# EAGLE board PFCEDU_V3 (EAGLE 9.1.1), part 1 of 2
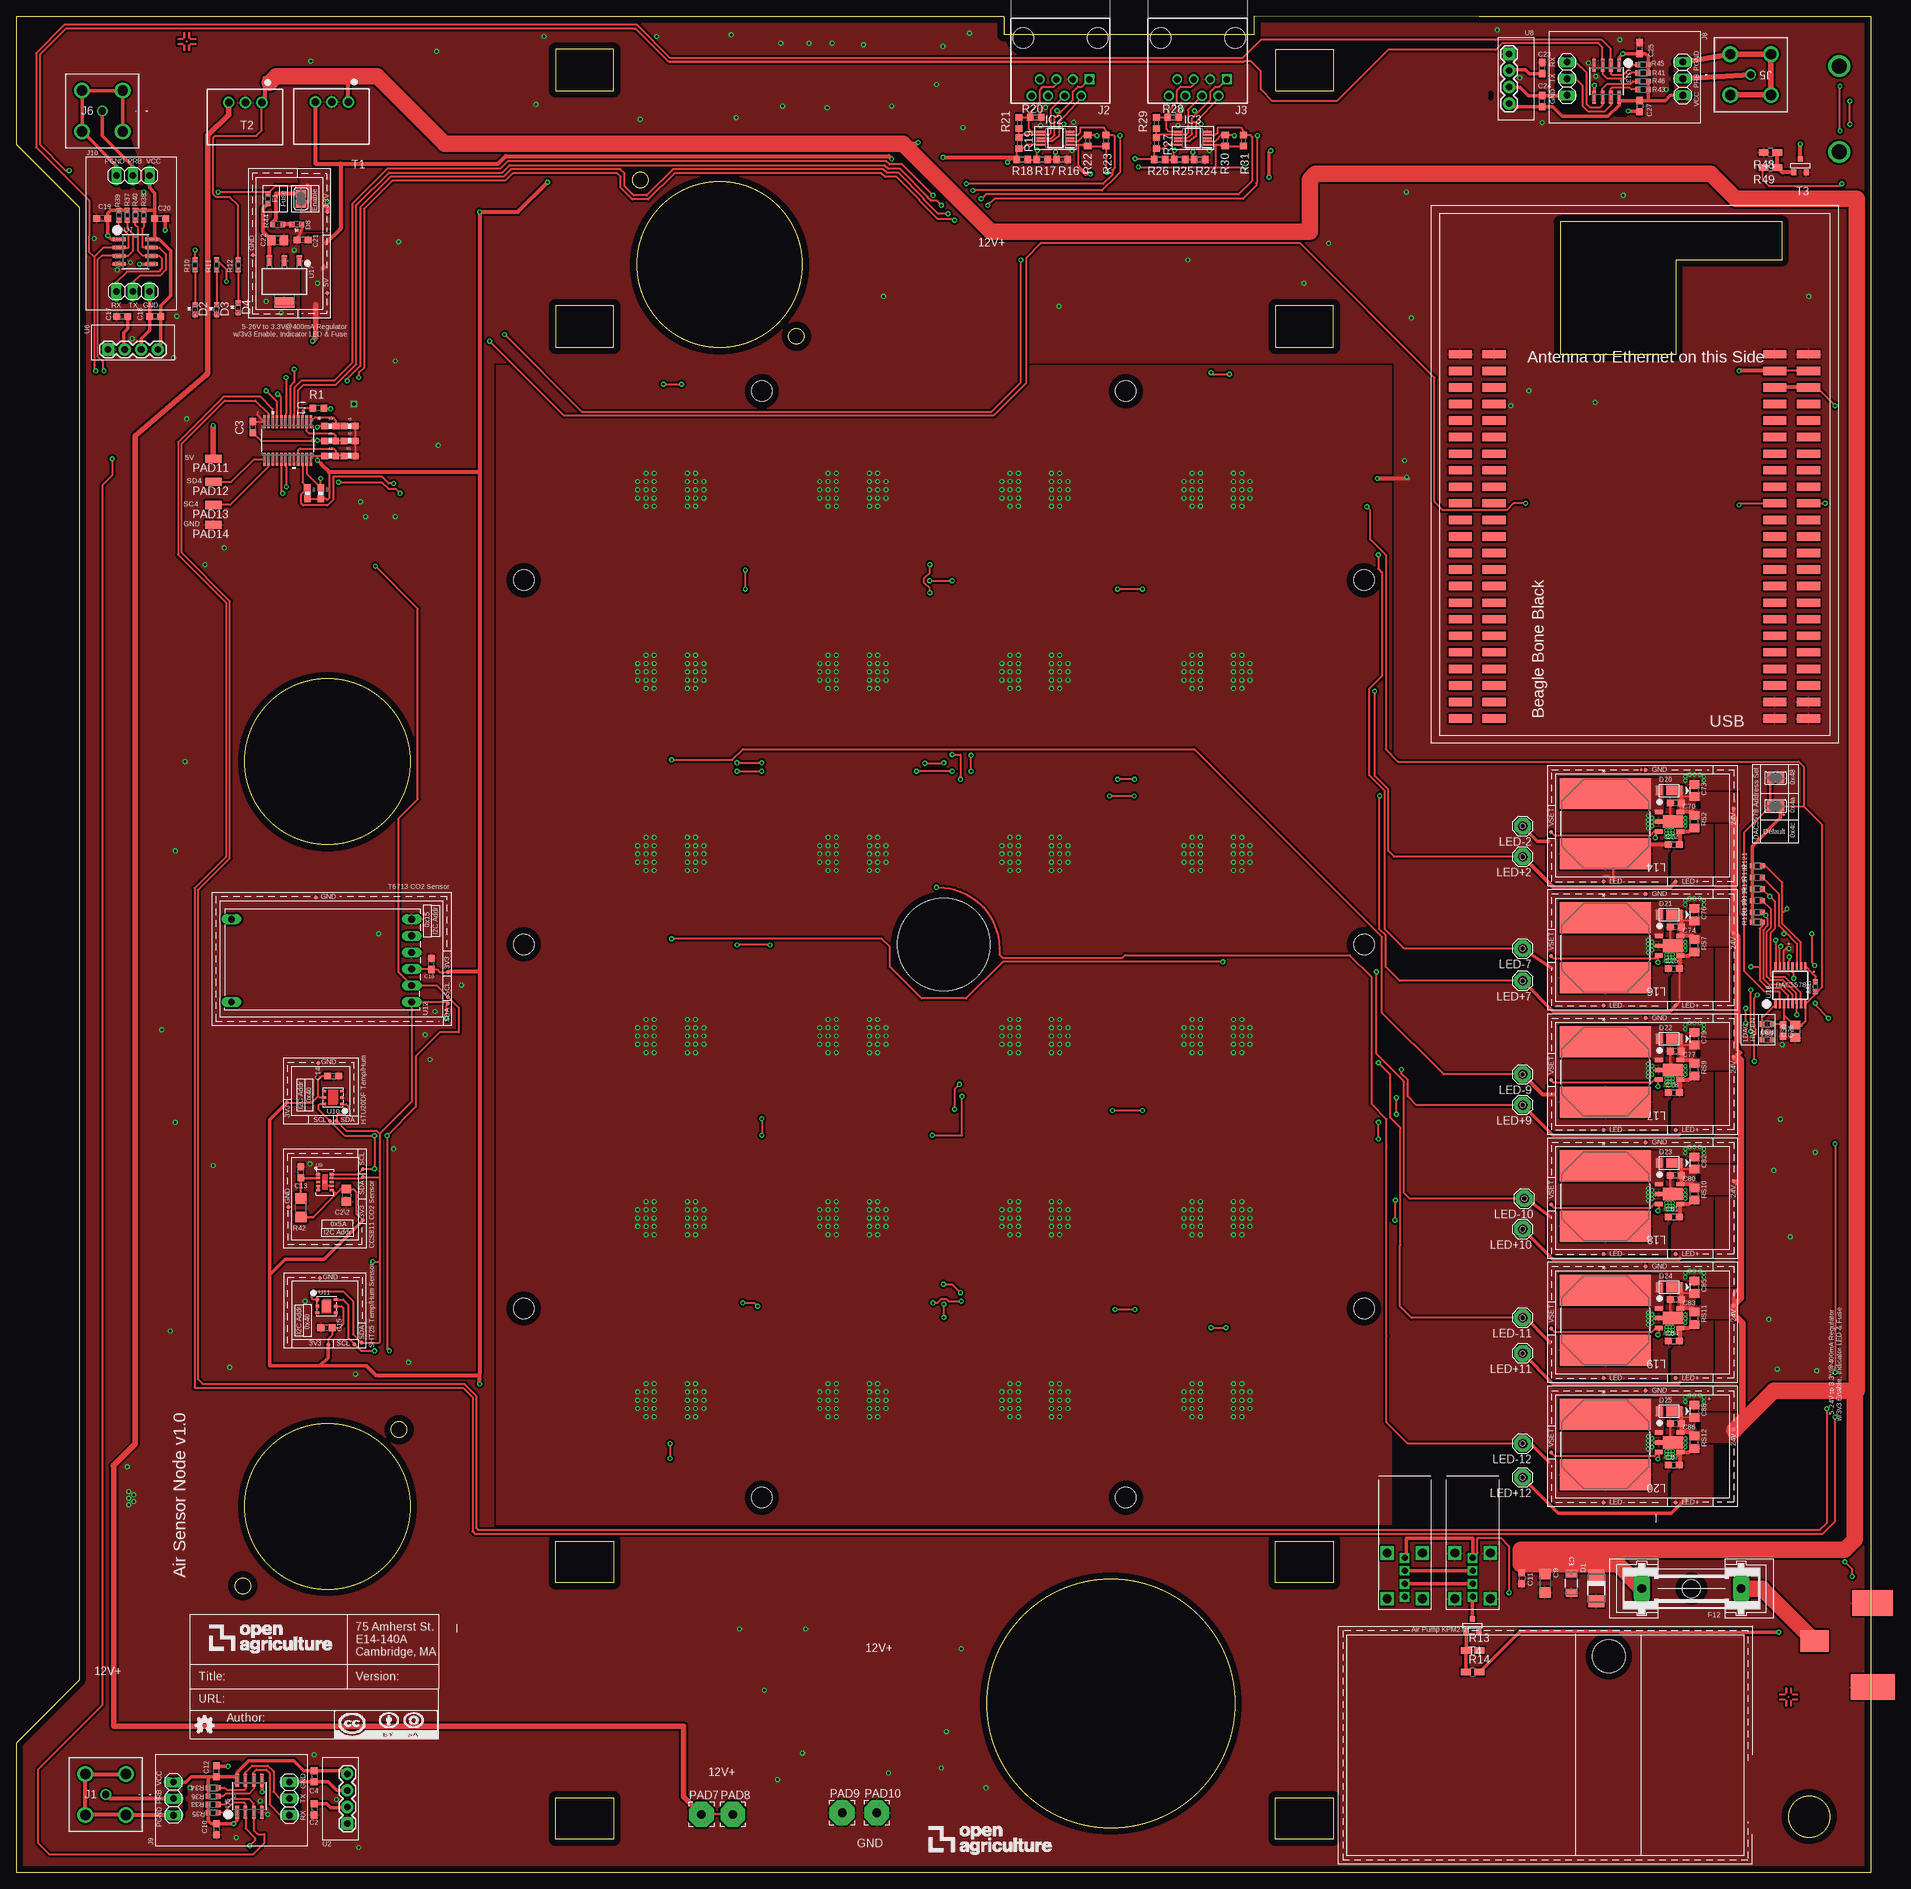
[diagram p5: board, top side]
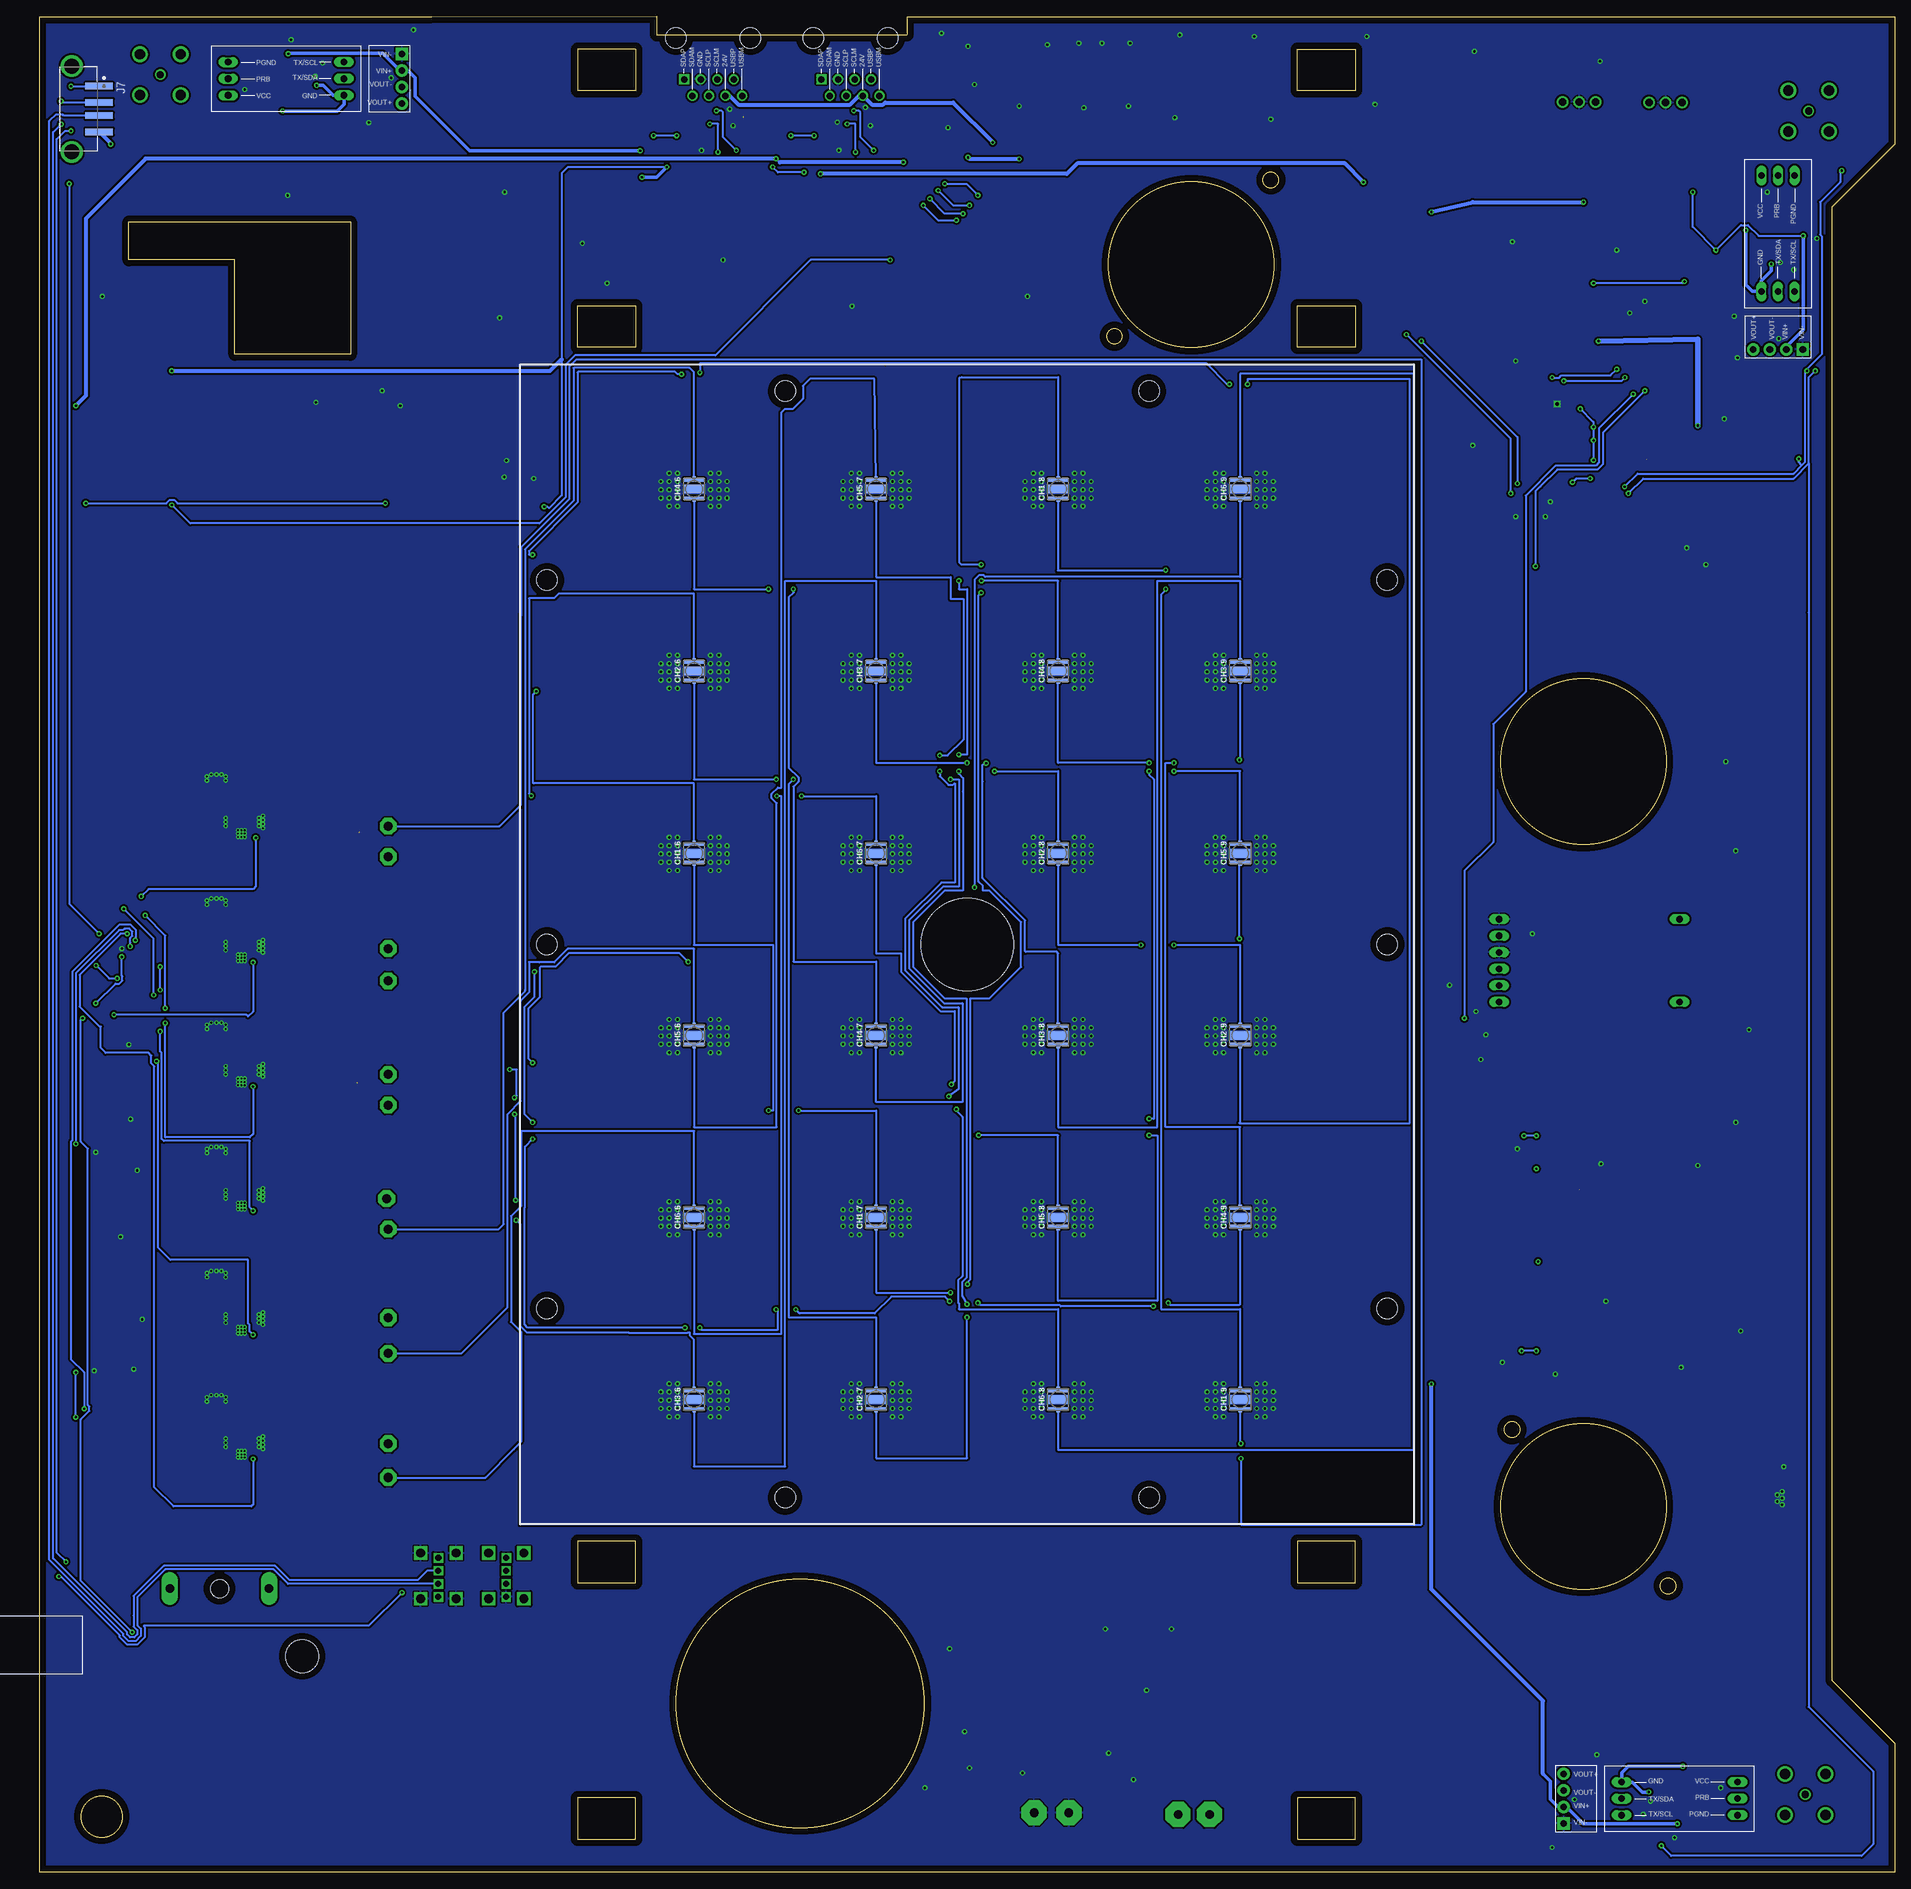
[diagram p6: board, bottom side, seen from below]

Size 284.73 x 284.79 mm. Coordinates in mm from the lower left corner, seen from the top.
Outline: 224.54,284.73 284.73,284.73 284.73,0 0,0 0,19.81 9.65,29.46 9.65,255.52 0,265.18 0,284.73 151.62,284.73 151.62,281.94 189.99,281.94 189.99,284.79 224.73,284.73
Outline: 91.66,279.71 82.77,279.71 82.77,273.36 91.66,273.36 91.66,279.71
Outline: 91.66,240.34 82.77,240.34 82.77,233.99 91.66,233.99 91.66,240.34
Outline: 202.15,240.34 193.26,240.34 193.26,233.99 202.15,233.99 202.15,240.34
Outline: 193.26,273.36 202.15,273.36 202.15,279.71 193.26,279.71 193.26,273.36
Outline: 202.15,11.43 202.15,5.08 193.26,5.08 193.26,11.43 202.15,11.43
Outline: 202.15,50.8 202.15,44.45 193.26,44.45 193.26,50.8 202.15,50.8
Outline: 91.66,11.43 91.66,5.08 82.77,5.08 82.77,11.43 91.66,11.43
Outline: 91.66,50.8 91.66,44.45 82.77,44.45 82.77,50.8 91.66,50.8
Outline: 236.98,253.24 236.98,232.92 254.76,232.92 254.76,247.4 271.02,247.4 271.02,253.24 236.98,253.24
Outline: circle at 275.2,8.55 radius 3.17
Outline: circle at 119.75,235.7 radius 1.2
Outline: circle at 95.76,259.68 radius 1.2
Outline: circle at 58.75,67.93 radius 1.2
Outline: circle at 34.76,43.94 radius 1.2
Outline: circle at 47.75,170.43 radius 12.7
Outline: circle at 47.75,56.13 radius 12.7
Outline: circle at 167.99,25.91 radius 19.05
Outline: circle at 107.95,246.69 radius 12.7
Copper layers (1*16): Top 0.035mm / dielectric 1.5mm / Bottom 0.035mm
Design rules "default *": minimum track width 6mil, minimum drill 0.35mm, track to track 4mil, track to pad 4mil, pad to pad 6mil, via to via 6mil, smd to smd 6mil, copper to edge 40mil, drill to drill 6mil, minimum pad ring 10mil, minimum via ring 8mil, stop-mask expansion 4mil, vias tented up to drill 25mil, thermal gap 10mil
Net classes: 0 default: width 0.305 mm, drill 0.254 mm, clearance 0.254 mm
Holes 3.17 mm at 114.43,57.48 170.31,57.48 206.86,86.51 206.86,142.39 206.86,198.27 170.31,227.28 114.43,227.28 77.88,198.27 77.88,142.39 77.88,86.51
Holes 14.22 mm at 142.37,142.37
Holes 5.08 mm at 244.42,33.15
tRestrict: 23 lines
Milling: 2 lines

## Footprints (pad centres in the part's own frame; a part is rotated, then mirrored left to right if it is on the bottom)
CAP_C1206 = smd 1.118 x 1.803: 1 -1.499,0; 2 1.499,0
C0603 = smd 1.1 x 1: 1 -0.85,0; 2 0.85,0
C0805 = smd 1.3 x 1.5: 1 -0.95,0; 2 0.95,0
C0603@1 = smd 1.1 x 1: 1 -0.85,0; 2 0.85,0
C1206 = smd 1.6 x 1.8: 1 -1.4,0; 2 1.4,0
CREE-XLAMP-XP-E = smd 0.5 x 3.3: A 1.4,0; C -1.4,0 | smd 0.45 x 0.5: A@1 1.725,0; C@1 -1.725,0 | smd 1.3 x 3.3: THERM 0,0
DO-214AC = smd 1.8 x 2.4: A 2.025,0; C -2.025,0
CHIPLED_0603 = smd 0.8 x 0.8: A 0,-0.75; C 0,0.75
POWERDI123 = smd 1.05 x 1.5: + -1.3,0 | smd 2.4 x 1.5: - 1.05,0
0603 = smd 0.756 x 0.8: 1 -0.778,0; 2 0.778,0
GSH15 = drill 1.321 pad 2.54 long: 1 -7.62,0; 2 7.62,0 | hole 2.794: 0,0
SOP50P490X110-10N = smd 1.4 x 0.3: 1 -2.2,1; 2 -2.2,0.5; 3 -2.2,0; 4 -2.2,-0.5; 5 -2.2,-1; 6 2.2,-1; 7 2.2,-0.5; 8 2.2,0; 9 2.2,0.5; 10 2.2,1
CONN5_5-1634503-1 = drill 1.092 pad 1.6: 1 0,0 | drill 1.6 pad 2.108: 2 -3.124,3.124; 3 -3.124,-3.124; 4 3.124,-3.124; 5 3.124,3.124
OPENAG-V1-RJ45 = drill 1: 24V(6) 1.905,8.89; DSCLM(5) 0.635,6.35; DSCLP(4) -0.635,8.89; DSDAM(2) -3.175,8.89; GND(3) -1.905,6.35; USBM(8) 4.445,8.89; USBP(7) 3.175,6.35 | drill 1 square: DSDAP(1) -4.445,6.35 | hole 3.2: -5.715,0; 5.715,0
CUI_UJ2-AV-1-SMT = smd 1 x 4.2: 1 0,0; 2 2.5,0; 3 4.5,0; 4 7,0 | drill 2.3: SH1 -3.07,-4.2; SH2 10.07,-4.2
ATLAS-STAMP = drill 1.016 long: 1 -8.89,2.54; 2 -8.89,0; 3 -8.89,-2.54; 4 8.89,-2.54; 5 8.89,0; 6 8.89,2.54
IND_BOURNS_SDR1307 = smd 4.75 x 13.995: 1 -4.623,0; 2 4.623,0
SE14 = drill 1.397 pad 2.54 octagon: MP 0,0
3,81/1,3 = drill 1.321 pad 3.81 octagon: 1 0,0
SMD1,27-2,54 = smd 1.27 x 2.54: 1 0,0
R0603 = smd 1 x 1.1: 1 -0.85,0; 2 0.85,0
0603-RES = smd 1.1 x 1: 1 -0.85,0; 2 0.85,0
RC0603N = smd 0.756 x 0.8: 1 -0.778,0; 2 0.778,0
R0805W = smd 1.5 x 1: 1 -1.052,0; 2 1.052,0
R1206 = smd 1.6 x 1.803: 1 -1.422,0; 2 1.422,0
R0805 = smd 1.3 x 1.5: 1 -0.95,0; 2 0.95,0
SJ1 = smd 1.168 x 1.6: 1 -0.762,0; 2 0.762,0
R-78E5.0-1.0 = drill 1.15 pad 1.75: 1 3.21,2; 2 5.75,2; 3 8.29,2
SOT-23 = smd 0.787 x 0.889: 1 0.025,-1.016; 2 -0.94,1.016; 3 0.991,1.016
TP06R = smd 0.6 x 0.6: TP 0,0
TP04R = smd 0.4 x 0.4: 1 0,0
PW24-M = smd 1.981 x 0.406: 1 -2.87,3.575; 2 -2.87,2.925; 3 -2.87,2.275; 4 -2.87,1.625; 5 -2.87,0.975; 6 -2.87,0.325; 7 -2.87,-0.325; 8 -2.87,-0.975; 9 -2.87,-1.625; 10 -2.87,-2.275; 11 -2.87,-2.925; 12 -2.87,-3.575; 13 2.87,-3.575; 14 2.87,-2.925; 15 2.87,-2.275; 16 2.87,-1.625; 17 2.87,-0.975; 18 2.87,-0.325; 19 2.87,0.325; 20 2.87,0.975; 21 2.87,1.625; 22 2.87,2.275; 23 2.87,2.925; 24 2.87,3.575
RM3.33.3S-SIP4 = drill 1.016 pad 1.88 square: 1 0,0 | drill 1.016 pad 1.88: 2 2.54,0; 3 5.08,0; 4 7.62,0
D8 = smd 1.981 x 0.559: 1 -2.464,1.905; 2 -2.464,0.635; 3 -2.464,-0.635; 4 -2.464,-1.905; 5 2.464,-1.905; 6 2.464,-0.635; 7 2.464,0.635; 8 2.464,1.905
CCS811 = smd 0.6 x 0.4: 1 -1.05,1.2; 2 -1.05,0.6; 3 -1.05,0; 4 -1.05,-0.6; 5 -1.05,-1.2; 6 1.05,-1.2; 7 1.05,-0.6; 8 1.05,0; 9 1.05,0.6; 10 1.05,1.2; EP 0,0
HTU20D(F) = smd 0.4 x 0.6: 1 -1,-1.35; 2 0,-1.35; 3 1,-1.35; 4 1,1.35; 5 0,1.35; 6 -1,1.35
SHT2X = smd 0.3 x 0.4: 1 -1,-1.4; 2 0,-1.4; 3 1,-1.4; 4 1,1.4; 5 0,1.4; 6 -1,1.4 | smd 1.651 x 1.27: 7 0,0
T6713 = drill 1.016 long: 1 1.27,-1.27; 2 1.27,-3.81; 3 1.27,-6.35; 4 1.27,-8.89; 5 1.27,-11.43; 6 1.27,-13.97; 7 28.96,-13.97; 8 28.96,-1.27
MP04A = smd 1.6 x 0.838: 1 -3.2,2.3; 2 -3.2,0; 3 -3.2,-2.3 | smd 1.6 x 3.099: 4 3.2,0
TSSOP16 = smd 0.35 x 1.2: 1 -2.275,-2.925; 2 -1.625,-2.925; 3 -0.975,-2.925; 4 -0.325,-2.925; 5 0.325,-2.925; 6 0.975,-2.925; 7 1.625,-2.925; 8 2.275,-2.925; 9 2.275,2.925; 10 1.625,2.925; 11 0.975,2.925; 12 0.325,2.925; 13 -0.325,2.925; 14 -0.975,2.925; 15 -1.625,2.925; 16 -2.275,2.925
PJ-036AH = smd 4.4 x 3.3: 1 2.2,-0.65 | smd 6.75 x 3.9: 2 -6.75,6.45 | smd 6.2 x 3.9: 3 -6.75,-6.45
23PINHEADERSMD = smd 1.27 x 3.556: AIN0 7.62,0; AIN1 7.62,5.207; AIN2 10.16,0; AIN3 10.16,5.207; AIN4 15.24,0; AIN5 12.7,5.207; AIN6 12.7,0; DGND 55.88,0; DGND1 2.54,0; DGND2 0,0; DGND3 0,5.207; DGND4 2.54,5.207; DGND5 55.88,5.207; DGND6 55.88,48.26; DGND7 55.88,53.467; ECAPWMO 5.08,5.207; EHRPWM1A 40.64,5.207; EHRPWM1B 38.1,5.207; EHRPWM2A 33.02,48.26; EHRPWM2B 40.64,48.26; GND_ADC 15.24,5.207; GPIO_20 5.08,0; GPIO_26 40.64,53.467; GPIO_27 35.56,48.26; GPIO_44 43.18,53.467; GPIO_45 43.18,48.26; GPIO_46 38.1,53.467; GPIO_47 38.1,48.26; GPIO_48 38.1,0; GPIO_49 27.94,0; GPIO_60 43.18,5.207; GPIO_61 25.4,53.467; GPIO_65 35.56,53.467; GPIO_66 48.26,48.26; GPIO_67 48.26,53.467; GPIO_68 45.72,53.467; GPIO_69 45.72,48.26; GPIO_112 20.32,5.207; GPIO_115 22.86,0; GPIO_117 25.4,0; I2C2_SCL 33.02,0; I2C_SDA 33.02,5.207; LCD_AC_BIAS 20.32,53.467; LCD_DATA0 0,48.26; LCD_DATA1 0,53.467; LCD_DATA2 2.54,48.26; LCD_DATA3 2.54,53.467; LCD_DATA4 5.08,48.26; LCD_DATA5 5.08,53.467; LCD_DATA6 7.62,48.26; LCD_DATA7 7.62,53.467; LCD_DATA8 10.16,48.26; LCD_DATA9 10.16,53.467; LCD_DATA10 12.7,53.467; LCD_DATA11 15.24,53.467; LCD_DATA12 12.7,48.26; LCD_DATA13 15.24,48.26; LCD_DATA14 17.78,48.26; LCD_DATA15 17.78,53.467; LCD_HSYNC 20.32,48.26; LCD_PCLK 22.86,53.467; LCD_VSYNC 22.86,48.26; MMC1_CLK 30.48,48.26; MMC1_CMD 33.02,53.467; MMC1_DAT0 25.4,48.26; MMC1_DAT1 27.94,53.467; MMC1_DAT2 50.8,48.26; MMC1_DAT3 50.8,53.467; MMC1_DAT4 27.94,48.26; MMC1_DAT5 30.48,53.467; MMC1_DAT6 53.34,48.26; MMC1_DAT7 53.34,53.467; PWR_BUT 45.72,0; SP11_CS0 22.86,5.207; SP11_DO 20.32,0; SP11_SCLK 17.78,0; SPIO_CS0 35.56,0; SPIO_D1 35.56,5.207; SPIO_DO 30.48,0; SPIO_SLCK 30.48,5.207; SYS5V 48.26,0; SYS5V1 48.26,5.207; SYS_RESET 45.72,5.207; UART1_RXD 25.4,5.207; UART1_TXD 27.94,5.207; UART4_RXD 43.18,0; UART4_TXD 40.64,0; VDD3.3 53.34,5.207; VDD3.31 53.34,0; VDD5V 50.8,0; VDD5V1 50.8,5.207; VDD_ADC 17.78,5.207
USB_RIGHT = drill 1.35 square: GND1 -2.72,-0.73; GND2 2.72,-0.73; GND3 -2.72,6.27; GND4 2.72,6.27 | drill 0.96 square: PIN1 0,0 | drill 0.92 square: PIN2 0,2; PIN3 0,4; PIN4 0,6
AL8861 = smd 0.68 x 1.2: 1 -1.5,-1.65; 2 0,-1.65; 3 1.5,-1.65; 4 1.5,1.65; 5 -1.5,1.65 | smd 1.93 x 3.05: 44 0,0.475

## Placement (x,y rotation side)
ATTRIBUTES  [DOCFIELD]  26.69,20.46 0 top
C1  4.7uF  [CAP_C1206]  238.69,44.36 270 top
C2  0.1uF  [C0603]  45.72,9.65 270 top
C2\2  4.7uF  [C0805]  50.66,103.88 270 top
C3  .1uF  [C0603@1]  36.31,221.75 90 top
C4  0.1uF  [C0603]  45.72,14.73 270 top
C9  10uF  [C1206]  234.63,44.36 270 top
C10  0.1uF  [C0603]  30.73,6.6 270 top
C11  .1uF  [C0603@1]  231.07,45.13 270 top
C12  0.1uF  [C0603]  30.73,15.49 90 top
C13  0.1uF  [C0603]  43.68,107.43 90 top
C14  0.1uF  [C0603]  48.63,122.17 0 top
C15  0.1uF  [C0603]  47.61,83.56 180 top
C16  0.1uF  [C0603]  63.74,139.39 90 top
C17  0.1uF  [C0603]  16.26,238.76 180 top
C18  0.1uF  [C0603]  21.34,238.76 180 top
C19  0.1uF  [C0603]  13.21,253.75 180 top
C20  0.1uF  [C0603]  22.1,253.75 0 top
C21  0.1uF  [C0603]  43.94,250.44 180 top
C22  10uF  [C0805]  40.13,250.44 0 top
C23  0.1uF  [C0603]  234.19,276.86 90 top
C24  0.1uF  [C0603]  234.19,271.78 90 top
C25  0.1uF  [C0603]  249.17,279.91 90 top
C26  0.1uF  [C0603]  271.14,129.16 270 top
C27  0.1uF  [C0603]  249.17,271.02 270 top
C30  4.7uF  [C0805]  273.05,129.03 270 top
C70  0.1uF  [C0603]  254.7,164.08 180 top
C72  0.1uF  [C0603]  254.38,157.73 0 top
C73  10uF  [C0805]  257.56,165.99 90 top
C74  0.1uF  [C0603]  254.7,145.03 180 top
C75  0.1uF  [C0603]  254.38,138.68 0 top
C76  10uF  [C0805]  257.56,146.94 90 top
C77  0.1uF  [C0603]  254.7,125.98 180 top
C78  0.1uF  [C0603]  254.38,119.63 0 top
C79  10uF  [C0805]  257.56,127.89 90 top
C80  0.1uF  [C0603]  254.7,106.93 180 top
C81  0.1uF  [C0603]  254.38,100.58 0 top
C82  10uF  [C0805]  257.56,108.84 90 top
C83  0.1uF  [C0603]  254.7,87.88 180 top
C84  0.1uF  [C0603]  254.38,81.53 0 top
C85  10uF  [C0805]  257.56,89.79 90 top
C86  0.1uF  [C0603]  254.7,68.83 180 top
C87  0.1uF  [C0603]  254.38,62.48 0 top
C88  10uF  [C0805]  257.56,70.74 90 top
CH1-6  XP-E  [CREE-XLAMP-XP-E]  184.28,156.36 90 bottom
CH1-7  XP-E  [CREE-XLAMP-XP-E]  156.34,100.48 90 bottom
CH1-8  XP-E  [CREE-XLAMP-XP-E]  128.4,212.24 90 bottom
CH1-9  XP-E  [CREE-XLAMP-XP-E]  100.46,72.54 90 bottom
CH2-6  XP-E  [CREE-XLAMP-XP-E]  184.28,184.3 90 bottom
CH2-7  XP-E  [CREE-XLAMP-XP-E]  156.34,72.54 90 bottom
CH2-8  XP-E  [CREE-XLAMP-XP-E]  128.4,156.36 90 bottom
CH2-9  XP-E  [CREE-XLAMP-XP-E]  100.46,128.42 90 bottom
CH3-6  XP-E  [CREE-XLAMP-XP-E]  184.28,72.54 90 bottom
CH3-7  XP-E  [CREE-XLAMP-XP-E]  156.34,184.3 90 bottom
CH3-8  XP-E  [CREE-XLAMP-XP-E]  128.4,128.42 90 bottom
CH3-9  XP-E  [CREE-XLAMP-XP-E]  100.46,184.3 90 bottom
CH4-6  XP-E  [CREE-XLAMP-XP-E]  184.28,212.24 90 bottom
CH4-7  XP-E  [CREE-XLAMP-XP-E]  156.34,128.42 90 bottom
CH4-8  XP-E  [CREE-XLAMP-XP-E]  128.4,184.3 90 bottom
CH4-9  XP-E  [CREE-XLAMP-XP-E]  100.46,100.48 90 bottom
CH5-6  XP-E  [CREE-XLAMP-XP-E]  184.28,128.42 90 bottom
CH5-7  XP-E  [CREE-XLAMP-XP-E]  156.34,212.24 90 bottom
CH5-8  XP-E  [CREE-XLAMP-XP-E]  128.4,100.48 90 bottom
CH5-9  XP-E  [CREE-XLAMP-XP-E]  100.46,156.36 90 bottom
CH6-6  XP-E  [CREE-XLAMP-XP-E]  184.28,100.48 90 bottom
CH6-7  XP-E  [CREE-XLAMP-XP-E]  156.34,156.36 90 bottom
CH6-8  XP-E  [CREE-XLAMP-XP-E]  128.4,72.54 90 bottom
CH6-9  XP-E  [CREE-XLAMP-XP-E]  100.46,212.24 90 bottom
D1  SMAJ14A  [DO-214AC]  242.5,43.6 270 top
D2  APT1608  [CHIPLED_0603]  27.44,239.78 180 top
D3  APT1608  [CHIPLED_0603]  30.74,239.78 180 top
D4  APT1608  [CHIPLED_0603]  34.05,240.04 180 top
D8  APT1608  [CHIPLED_0603]  43.05,252.86 270 top
D20  SBR2A40P1-7  [POWERDI123]  253.43,165.99 0 top
D21  SBR2A40P1-7  [POWERDI123]  253.43,146.94 0 top
D22  SBR2A40P1-7  [POWERDI123]  253.43,127.89 0 top
D23  SBR2A40P1-7  [POWERDI123]  253.43,108.84 0 top
D24  SBR2A40P1-7  [POWERDI123]  253.43,89.79 0 top
D25  SBR2A40P1-7  [POWERDI123]  253.43,70.74 0 top
F1  400mA  [0603]  38.61,256.79 90 top
F12  [GSH15]  257.12,43.52 180 top
IC2  PCA9615DP  [SOP50P490X110-10N]  159.5,266.11 180 top
IC3  PCA9615DP  [SOP50P490X110-10N]  180.58,266.11 180 top
J1  5-1634503-1  [CONN5_5-1634503-1]  13.72,11.94 0 top
J2  54602-908LF  [OPENAG-V1-RJ45]  160.26,281.48 180 top
J3  54602-908LF  [OPENAG-V1-RJ45]  181.35,281.48 180 top
J5  5-1634503-1  [CONN5_5-1634503-1]  266.19,275.84 180 top
J6  5-1634503-1  [CONN5_5-1634503-1]  13.21,270.26 0 top
J7  UJ2-AV-1-SMT  [CUI_UJ2-AV-1-SMT]  275.59,274.07 270 bottom
J8  ATLAS-STAMP  [ATLAS-STAMP]  246.89,275.21 0 top
J9  ATLAS-STAMP  [ATLAS-STAMP]  33.02,11.3 180 top
J10  ATLAS-STAMP  [ATLAS-STAMP]  17.91,251.46 90 top
L14  100UH  [IND_BOURNS_SDR1307]  243.9,160.91 270 top
L16  100UH  [IND_BOURNS_SDR1307]  243.9,141.86 270 top
L17  100UH  [IND_BOURNS_SDR1307]  243.9,122.81 270 top
L18  100UH  [IND_BOURNS_SDR1307]  243.9,103.76 270 top
L19  100UH  [IND_BOURNS_SDR1307]  243.9,84.71 270 top
L20  100UH  [IND_BOURNS_SDR1307]  243.9,65.66 270 top
LED+2  SE14  [SE14]  231.2,155.83 180 top
LED+7  SE14  [SE14]  231.2,136.78 180 top
LED+9  SE14  [SE14]  231.2,117.73 180 top
LED+10  SE14  [SE14]  231.2,98.68 180 top
LED+11  SE14  [SE14]  231.2,79.63 180 top
LED+12  SE14  [SE14]  231.2,60.58 180 top
LED-2  SE14  [SE14]  231.2,160.53 180 top
LED-7  SE14  [SE14]  231.2,141.73 180 top
LED-9  SE14  [SE14]  231.2,122.43 180 top
LED-10  SE14  [SE14]  231.46,103.38 180 top
LED-11  SE14  [SE14]  231.2,85.09 180 top
LED-12  SE14  [SE14]  231.2,65.79 180 top
PAD7  WIREPAD3,81/1,3  [3,81/1,3]  105.16,8.89 0 top
PAD8  WIREPAD3,81/1,3  [3,81/1,3]  109.98,8.89 0 top
PAD9  WIREPAD3,81/1,3  [3,81/1,3]  126.75,9.14 0 top
PAD10  WIREPAD3,81/1,3  [3,81/1,3]  132.08,9.14 0 top
PAD11  [SMD1,27-2,54]  30.23,216.92 90 top
PAD12  [SMD1,27-2,54]  30.23,213.36 90 top
PAD13  [SMD1,27-2,54]  30.23,209.8 90 top
PAD14  [SMD1,27-2,54]  30.23,206.76 90 top
R1  10K  [R0603]  46.35,224.67 0 top
R2  10K  [0603-RES]  48.18,217.36 180 top
R3  10K  [0603-RES]  51.17,217.36 180 top
R4  10K  [0603-RES]  48.2,221.9 180 top
R5  10K  [0603-RES]  51.17,221.9 180 top
R6  10K  [0603-RES]  48.18,219.64 180 top
R7  10K  [0603-RES]  51.17,219.64 180 top
R8  10K  [0603-RES]  44.71,211.59 270 top
R9  10K  [0603-RES]  46.73,211.59 270 top
R10  100  [RC0603N]  27.44,246.64 90 top
R11  100  [RC0603N]  30.74,246.64 90 top
R12  100  [RC0603N]  34.05,246.64 90 top
R13  [R0805W]  223.52,34.04 0 top
R14  [R0805W]  223.52,30.73 0 top
R16  600  [R0603]  160.52,262.81 0 top
R17  120  [R0603]  157.47,262.81 0 top
R18  600  [R0603]  154.42,262.81 0 top
R19  600  [R0603]  153.91,265.35 270 top
R20  600  [R0603]  156.45,269.28 180 top
R21  120  [R0603]  153.91,268.39 270 top
R22  10K  [R0603]  164.45,265.73 270 top
R23  10K  [R0603]  167.25,265.73 270 top
R24  600  [R0603]  181.6,262.81 0 top
R25  120  [R0603]  178.55,262.81 0 top
R26  600  [R0603]  175.5,262.81 0 top
R27  600  [R0603]  175,265.35 270 top
R28  600  [R0603]  177.54,269.28 180 top
R29  120  [R0603]  175,268.39 270 top
R30  10K  [R0603]  185.54,265.73 270 top
R31  10K  [R0603]  188.33,265.73 270 top
R33  1K  [RC0603N]  30.23,10.41 180 top
R34  1K  [RC0603N]  30.23,12.95 180 top
R35  1K  [RC0603N]  30.23,9.14 180 top
R36  1K  [RC0603N]  30.23,11.68 180 top
R37  1K  [RC0603N]  17.02,254.25 90 top
R38  1K  [RC0603N]  19.56,254.25 90 top
R39  1K  [RC0603N]  15.75,254.25 90 top
R40  1K  [RC0603N]  18.29,254.25 90 top
R41  1K  [RC0603N]  249.68,276.1 0 top
R42  4.7K  [R1206]  43.68,101.97 270 top
R43  1K  [RC0603N]  249.68,273.56 0 top
R44  100  [RC0603N]  40.13,252.86 180 top
R45  1K  [RC0603N]  249.68,277.37 0 top
R46  1K  [RC0603N]  249.68,274.83 0 top
R48  [R0805W]  269.24,263.91 180 top
R49  [R0805W]  269.24,261.62 180 top
R88  1K  [RC0603N]  276.1,135.89 90 top
R89  0 OHM  [RC0603N]  268.73,127.76 180 top
R90  1K  [RC0603N]  268.73,130.18 180 top
R117  1K  [RC0603N]  267.21,150.88 180 top
R118  1K  [RC0603N]  267.21,149.1 180 top
R119  1K  [RC0603N]  267.21,147.32 180 top
R120  1K  [RC0603N]  267.21,145.8 180 top
R121  1K  [RC0603N]  267.21,154.43 180 top
R122  1K  [RC0603N]  267.21,152.65 180 top
RS2  .06 ohms  [R0805]  257.56,161.23 90 top
RS7  .06 ohms  [R0805]  257.56,142.18 90 top
RS9  .06 ohms  [R0805]  257.56,123.13 90 top
RS10  .06 ohms  [R0805]  257.56,104.08 90 top
RS11  .06 ohms  [R0805]  257.56,85.03 90 top
RS12  .06 ohms  [R0805]  257.56,65.98 90 top
SJ1  [SJ1]  43.69,256.79 270 top
SJ_A1  [SJ1]  270,163.58 180 top
SJ_A2  [SJ1]  270,167.89 180 top
T1  R-78E5.0-1.0  [R-78E5.0-1.0]  54.17,273.64 180 top
T2  R-78E12.0-1.0  [R-78E5.0-1.0]  40.89,273.56 180 top
T3  [SOT-23]  273.81,261.87 180 top
T4  [SOT-23]  223.52,37.85 180 top
TP1  TPTP06R  [TP06R]  53.2,107.94 180 top
TP2  TPTP06R  [TP06R]  53.2,106.67 180 top
TP3  TPTP06R  [TP06R]  41.77,102.1 180 top
TP5  TPTP06R  [TP06R]  53.2,100.07 180 top
TP6  TPTP06R  [TP06R]  49.14,115.31 90 top
TP7  TPTP06R  [TP06R]  48.12,115.31 90 top
TP36  TPTP06R  [TP06R]  41.52,118.1 90 top
TP37  TPTP06R  [TP06R]  46.34,124.2 90 top
TP38  TPTP06R  [TP06R]  52.95,81.27 90 top
TP39  TPTP06R  [TP06R]  51.93,81.02 90 top
TP40  TPTP06R  [TP06R]  46.6,91.18 90 top
TP41  TPTP06R  [TP06R]  47.87,81.02 90 top
TP42  TPTP06R  [TP06R]  66.28,133.29 180 top
TP43  TPTP06R  [TP06R]  66.28,134.31 180 top
TP44  TPTP06R  [TP06R]  66.28,138.12 180 top
TP45  TPTP06R  [TP06R]  45.96,149.55 180 top
TP61  TPTP06R  [TP06R]  36.32,248.16 270 top
TP62  TPTP06R  [TP06R]  47.75,242.32 270 top
TP63  TPTP06R  [TP06R]  47.75,254.76 270 top
TP99  TPTP04R  [TP04R]  263.65,164.34 180 top
TP100  TPTP04R  [TP04R]  271.27,162.31 180 top
TP101  TPTP04R  [TP04R]  272.03,142.49 0 top
TP104  TPTP04R  [TP04R]  267.97,131.32 180 top
TP105  TPTP04R  [TP04R]  275.84,138.18 180 top
TP106  TPTP04R  [TP04R]  249.43,169.16 90 top
TP107  TPTP04R  [TP04R]  259.84,72.64 270 top
TP112  TPTP06R  [TP06R]  243.59,152.02 90 top
TP113  TPTP06R  [TP06R]  263.59,163.19 90 top
TP114  TPTP06R  [TP06R]  250.06,169.16 90 top
TP115  TPTP06R  [TP06R]  254.7,152.02 180 top
TP116  TPTP06R  [TP06R]  235.59,159.64 180 top
TP117  TPTP06R  [TP06R]  243.59,132.97 90 top
TP118  TPTP06R  [TP06R]  263.59,144.15 90 top
TP119  TPTP06R  [TP06R]  250.06,150.11 90 top
TP120  TPTP06R  [TP06R]  254.7,132.97 180 top
TP121  TPTP06R  [TP06R]  235.59,140.59 180 top
TP122  TPTP06R  [TP06R]  243.59,113.92 90 top
TP123  TPTP06R  [TP06R]  263.59,125.09 90 top
TP124  TPTP06R  [TP06R]  250.06,131.06 90 top
TP125  TPTP06R  [TP06R]  254.7,113.92 180 top
TP126  TPTP06R  [TP06R]  235.59,121.54 180 top
TP127  TPTP06R  [TP06R]  243.59,94.87 90 top
TP128  TPTP06R  [TP06R]  263.59,106.05 90 top
TP129  TPTP06R  [TP06R]  250.06,112.01 90 top
TP130  TPTP06R  [TP06R]  254.7,94.87 180 top
TP131  TPTP06R  [TP06R]  235.59,102.49 180 top
TP132  TPTP06R  [TP06R]  243.59,75.82 90 top
TP133  TPTP06R  [TP06R]  263.59,87 90 top
TP134  TPTP06R  [TP06R]  250.06,92.96 90 top
TP135  TPTP06R  [TP06R]  254.7,75.82 180 top
TP136  TPTP06R  [TP06R]  235.59,83.44 180 top
TP137  TPTP06R  [TP06R]  243.59,56.77 90 top
TP138  TPTP06R  [TP06R]  263.59,67.94 90 top
TP139  TPTP06R  [TP06R]  250.06,73.91 90 top
TP140  TPTP06R  [TP06R]  254.7,56.77 180 top
TP141  TPTP06R  [TP06R]  235.59,64.39 180 top
U1  TCA9548APWRPW24-M  [PW24-M]  41.65,219.72 270 top
U2  RM-3.33.3S  [RM3.33.3S-SIP4]  50.8,7.49 90 top
U5  ISO1540  [D8]  35.81,11.68 90 top
U6  RM-3.33.3S  [RM3.33.3S-SIP4]  14.1,233.68 0 top
U7  ISO1540  [D8]  18.29,248.67 0 top
U8  RM-3.33.3S  [RM3.33.3S-SIP4]  229.11,279.02 270 top
U9  CCS811  [CCS811]  47.36,105.91 0 top
U10  HPP845E034R5  [HTU20D(F)]  48.63,118.86 90 top
U11  SHT25  [SHT2X]  47.61,86.86 270 top
U12  T6713-5K  [T6713]  61.96,132.27 180 top
U13  ISO1540  [D8]  244.09,274.83 270 top
U17  LM2937-3.3V  [MP04A]  41.15,244.09 270 top
U18  DAC5578  [TSSOP16]  272.29,136.14 0 top
U$1  [PASSER-CIRCLE]  26.16,280.92 0 top
U$2  [PASSER-CIRCLE]  272.03,26.92 0 top
U$3  PJ-036AH  [PJ-036AH]  278.17,34.86 180 top
U$4  BBB_SMD  [23PINHEADERSMD]  275.08,177.04 90 top
U$5  USB_RIGHT  [USB_RIGHT]  223.52,48.26 180 top
U$6  USB_RIGHT  [USB_RIGHT]  213.11,48.26 180 top
U$9  [OPENAG-LOGO-750-MIL]  140.07,3.08 0 top
U$25  AL8861  [AL8861]  253.75,161.23 270 top
U$26  AL8861  [AL8861]  253.75,142.18 270 top
U$27  AL8861  [AL8861]  253.75,123.13 270 top
U$28  AL8861  [AL8861]  253.75,104.08 270 top
U$29  AL8861  [AL8861]  253.75,85.03 270 top
U$30  AL8861  [AL8861]  253.75,65.98 270 top

## Tracks (layer width: path | path; a pad name or v marks a point on that pad's centre or on a via)
24V_IN
  Top 2.54: U$3.1 267.96,43.52 F12.1
!LDAC!
  Top 0.305: R89.2 R90.2 267.95,130.81 267.95,131.16 | U18.1 267.95,131.16 | TP104.1 267.95,131.3 267.95,131.16
+3V3  (via drill 0.35)  (1 unrouted)
  Top 0.305: U1.24 45.73,217.36 46.22,217.36 | 46.22,217.36 R2.2 | R6.2 46.3,219.64 | 46.3,219.64 v46.22,219.72 | 46.22,217.36 v46.22,216.67 46.73,216.16 | R4.2 46.37,221.91 v46.22,221.75 | R1.2 48.12,224.67 v48.25,224.55 | C3.1 37.57,219.64 46.3,219.64 | IC2.1 163.06,265.11 | 163.06,265.11 163.68,265.11 163.91,264.88 R22.2 R23.2 167.25,261 v167.39,260.86 | 163.06,261.66 163.06,265.11 | IC3.1 184.14,265.11 | 184.14,265.11 184.76,265.11 184.99,264.88 R30.2 R31.2 | 184.14,261.66 184.14,265.11 | v172.2,261.66 184.14,261.66 | 184.14,261.66 v188.46,261.66 | C2\2.1 51.74,104.83 52.19,104.39 52.19,101.08 TP5.TP | C14.1 46.85,122.17 46.34,121.66 46.34,119.12 | U10.5 46.6,118.86 46.34,119.12 | TP36.TP 45.33,118.1 46.34,119.12 | U11.5 49.9,86.86 50.16,86.61 50.16,84.07 49.65,83.56 C15.1 48.47,82.38 47.87,81.78 TP41.TP | U12.3 63.65,138.62 C16.1 64.59,138.53 65.01,138.12 TP44.TP | 48.01,214.88 48.01,210.82 47.75,210.57 47.58,210.74 R9.2 R8.2 | v207.26,209.55 207.8,209.01 207.8,204.54 210.17,202.16 210.17,172.35 212.09,170.43 273.56,170.43 274.32,169.67 274.32,163.58 | v30.99,257.81 38.37,257.81 F1.2 39.84,258.81 44.68,258.81 | U$4.VDD3.31 U$4.VDD3.3 | U18.3 271.31,131.57 | 271.31,131.57 271.31,130.3 | 271.31,130.3 271.31,130.18 C26.1 | C30.1 272.9,129.98 271.31,131.57 | R90.1 271.19,130.18 271.31,130.3 | 276.1,134.75 U18.8 274.56,130.54 274,129.98 | 276.1,134.75 R88.1 | TP100.1 270.76,162.31 | SJ_A1.1 274.32,163.58 | 274.32,163.58 277.11,160.78 277.11,135.77 276.1,134.75 | R10.2 27.44,248.91 v27.43,248.92 | 48.68,104.44 U9.6
  Top 0.406: 49.05,104.07 48.68,104.44 | 49.05,104.07 45.54,100.55 R42.2 | 49.05,104.07 49.82,104.83 C2\2.1
  Top 0.508: 274,129.98 C30.1
  Top 0.559: TP36.TP 38.88,115.46 38.88,91.69 | 38.88,91.69 38.88,77.72 46.6,77.72 | 53.71,77.72 46.6,77.72 | 38.88,91.69 41.29,94.1 47.23,94.1 TP5.TP | TP41.TP 47.87,78.99 46.6,77.72 | SJ_A1.1 270.76,162.31 270.76,161.8 266.43,157.46 R121.2 R122.2 R117.2 R118.2 R119.2 R120.2 | C2.1 47.66,10.5 48.26,9.91 50.67,9.91 U2.2 | U5.1 33.91,8 v33.36,7.45 C10.1 29.88,7.45 29.45,7.89 R35.2 R33.2 | C17.1 17.11,236.82 16.51,236.22 16.51,233.81 U6.2 | U7.1 14.61,250.57 v14.06,251.12 C19.1 14.06,254.6 14.49,255.03 R39.2 R37.2 | C23.1 232.24,276.01 231.65,276.61 229.24,276.61 U8.2 | U13.1 246,278.51 v246.55,279.06 C25.1 250.02,279.06 250.46,278.62 R45.2 R41.2 | v192.53,264.16 192.28,263.91 v192.28,260.1
  Top 0.61: SJ1.2 44.02,256.36 44.74,256.36 45.1,256.72 45.1,258.39 44.68,258.81 | 71.12,138.18 71.12,76.45 | 53.71,77.72 55.23,76.2 70.87,76.2 71.12,76.45 | 71.12,138.18 66.34,138.18 TP44.TP | v47.75,256.29 47.75,256.03 47.5,255.78 47.75,255.52 TP63.TP | 71.12,214.88 v71.12,254.76 76.96,254.76 v81.53,259.33 | 71.12,214.88 71.12,203.71 71.12,138.18 | 46.73,216.16 48.01,214.88 71.12,214.88 | v164.85,260.6 164.12,260.6 163.06,261.66 | U$4.VDD3.3 v264.41,230.38 | v71.12,74.93 71.12,76.45
  Bottom 0.305: v46.22,216.67 v46.22,219.72 v46.22,221.75 46.22,222.38 arc-45 46.31,222.61 v48.25,224.55 | v167.39,260.86 171.4,260.86 v172.2,261.66 | v188.46,261.66 203.66,261.66 204.6,260.73 204.6,232.16 204.6,211.27 206.54,209.33 206.76,209.55 v207.26,209.55 | v30.99,257.81 30.99,252.48 v27.43,248.92 23.6,252.75 22.54,252.75 20.86,251.08 14.02,251.08
  Bottom 0.559: 53.98,15.11 52.83,13.97 52.83,11.18 51.69,10.03 U2.2 50.42,10.03 47.8,7.42 33.4,7.42 v33.36,7.45 | U6.2 16.64,234.06 14.02,236.68 14.02,251.08 v14.06,251.12 | v246.55,279.06 246.51,279.1 232.1,279.1 229.49,276.48 U8.2 228.22,276.48 227.08,275.34 227.08,272.54 218.69,264.16 v192.53,264.16 | v192.28,260.1 190.03,260.1 v188.46,261.66
  Bottom 0.61: v71.12,254.76 64.77,256.29 v47.75,256.29 | v81.53,259.33 84.42,262.22 125.44,262.22 127.06,260.6 v164.85,260.6 | v264.41,230.38 206.38,230.38 204.6,232.16 | 53.98,15.11 53.98,26.29 71.12,43.43 v71.12,74.93
  pour Top: 48.26,251.97 43.56,251.97 43.56,261.37 48.26,261.37
+5V  (via drill 0.35)
  Top 0.305: IC2.10 155.07,265.11 154.42,264.46 153.95,264.46 | 153.95,264.46 R19.2 | 153.95,264.46 153.57,264.08 R18.1 152.57,262.81 v152.15,262.38 | IC3.10 176.66,265.11 176.01,264.46 175.03,264.46 | 175.03,264.46 R27.2 | 175.03,264.46 174.65,264.08 R26.1 174.53,262.93 v171.69,262.93 | v32.26,244.09 32.26,245.91 R11.2 | U$4.VDD5V 276.35,227.84 v279.15,225.04
  Top 0.61: T1.3 45.88,262.18 49.78,262.18 | 49.78,262.18 73.97,262.18 75.12,263.33 133.92,263.33 v134.37,262.89 | v142.24,263.14 153.23,263.14 R18.1 | 47.24,246.38 46.99,246.13 | 49.78,262.18 49.78,252.22 47.5,249.94 | U$4.VDD5V U$4.VDD5V1
  Top 0.813: PAD11.1 v30.23,222 | v45.47,234.95 45.97,235.46 45.97,240.54
  Bottom 0.305: 171.14,262.38 v171.69,262.93 | v32.26,244.09 32.51,243.84 v46.23,243.84
  Bottom 0.61: v134.37,262.89 141.99,262.89 v142.24,263.14 | v152.15,262.38 171.14,262.38 | v171.69,262.93 268.44,262.93 277.62,253.75 277.62,226.57 v279.15,225.04
  Bottom 0.813: v30.23,222 30.23,235.2 v45.47,234.95
  pour Top: 48.26,251.08 43.81,251.08 43.81,238.51 48.26,238.51
+12V
  Top 0.305: PAD8.1 PAD7.1 104.65,8.89
  Top 0.813: 104.65,8.89 105.16,8.38 105.66,8.38 PAD7.1 102.44,11.61 102.44,22.43 14.99,22.43 14.99,62.23 14.86,62.36 18.25,65.75 18.25,73.91 18.25,220.45 28.96,229.62 29.39,230.05 29.39,266.51 32.6,269.72 T2.3
+24V  (via drill 0.35)
  Top 0.305: T2.1 37.68,267.3 36.83,266.45 30.48,266.45 30.35,266.32 30.23,266.19 30.23,258.16 30.2,258.13 30.2,257.49 30.66,257.02 32.79,257.02 34.05,255.77 R12.2 | D1.C 242.5,46.92 242.82,47.24 | C1.1 239.01,46.19 239.01,47.24 | C9.1 235.2,46.34 235.2,47.75 234.95,48.01 232.92,48.01 232.92,47.82 C11.1 231.07,47.06 230.89,47.24 | C73.1 255.67,165.04 255.55,164.92 | C76.1 255.67,145.99 255.55,145.87 | C79.1 255.67,126.94 255.55,126.82 | C82.1 255.67,107.89 255.55,107.77 | C85.1 255.67,88.84 255.55,88.72 | C88.1 255.67,69.79 255.55,69.67
  Top 0.559: TP133.TP 263.59,88.84 264.67,89.92 264.67,105.66 263.97,105.66 TP128.TP 264.03,106.05 264.67,106.68 264.67,109.73 264.67,123.7 263.59,124.78 TP123.TP 264.03,125.09 264.16,125.22 264.67,125.73 264.16,126.24 264.16,127.51 | 263.59,161.8 TP113.TP
  Top 0.61: v138.43,265.43 138.21,265.21 136.11,265.21 | T2.1 38.1,271.97 38.1,275.34 38.86,274.57 | T1.1 50.96,275.43 50.8,275.59 | RS2.2 257.24,162.81 255.33,162.81 255.55,163.03 C70.1 255.55,164.92 254.75,165.72 D20.- | RS7.2 257.24,143.76 255.33,143.76 255.55,143.98 C74.1 255.55,145.87 254.75,146.67 D21.- | RS9.2 257.24,124.71 255.33,124.71 255.55,124.93 C77.1 255.55,126.82 254.75,127.62 D22.- | RS10.2 257.24,105.66 255.33,105.66 255.55,105.88 C80.1 255.55,107.77 254.75,108.57 D23.- | RS11.2 257.24,86.61 255.33,86.61 255.55,86.83 C83.1 255.55,88.72 254.75,89.52 D24.- | RS12.2 257.24,67.56 255.33,67.56 255.55,67.78 C86.1 255.55,69.67 254.75,70.47 D25.-
  Top 1.016: 263.68,67.85 TP138.TP 264.92,69.28 264.92,84.33 263.59,85.66 TP133.TP 264.67,88.08 264.67,88.65 264.67,109.73 264.67,124.71 264.16,125.22 | 264.16,127.51 264.16,143.57 TP118.TP 263.59,161.8
  Top 2.54: 282.45,73.91 282.45,119.38 282.45,256.79 263.91,256.79 260.1,260.6 199.39,260.6 198.52,259.73 198.52,251.71 149.61,251.71 136.11,265.21 65.75,265.21 55.37,275.59 50.8,275.59 39.88,275.59 38.86,274.57 | F12.2 245.77,47.24 242.82,47.24 239.01,47.24 230.89,47.24 230.89,49.53 280.67,49.53 282.19,51.05 282.19,73.66 282.45,73.91 | 263.68,67.85 269.75,73.91 282.45,73.91
  Bottom 0.61: J3.24V(6) 178.83,272.58 177.47,271.22 160.33,271.22 158.97,272.58 J2.24V(6) 157,271.22 155.25,271.22 154.95,271.53 144.53,271.53 v138.43,265.43
  pour Top (isolate 0.305, no thermals): 253.43,165.35 253.43,166.62 255.97,166.62 255.97,165.67 264.22,165.67 264.22,161.23 258.51,161.23 258.51,161.86 256.92,161.86 256.92,162.5 255.02,162.5 255.02,165.35
  pour Top (isolate 0.305, no thermals): 253.43,146.3 253.43,147.57 255.97,147.57 255.97,146.62 264.22,146.62 264.22,142.18 258.51,142.18 258.51,142.81 256.92,142.81 256.92,143.45 255.02,143.45 255.02,146.3
  pour Top (isolate 0.305, no thermals): 253.43,127.25 253.43,128.52 255.97,128.52 255.97,127.57 264.22,127.57 264.22,123.13 258.51,123.13 258.51,123.76 256.92,123.76 256.92,124.4 255.02,124.4 255.02,127.25
  pour Top (isolate 0.305, no thermals): 253.43,108.2 253.43,109.47 255.97,109.47 255.97,108.52 264.22,108.52 264.22,104.08 258.51,104.08 258.51,104.71 256.92,104.71 256.92,105.35 255.02,105.35 255.02,108.2
  pour Top (isolate 0.305, no thermals): 253.43,89.15 253.43,90.42 255.97,90.42 255.97,89.47 264.22,89.47 264.22,85.03 258.51,85.03 258.51,85.66 256.92,85.66 256.92,86.3 255.02,86.3 255.02,89.15
  pour Top (isolate 0.305, no thermals): 253.43,70.1 253.43,71.37 255.97,71.37 255.97,70.42 264.22,70.42 264.22,65.98 258.51,65.98 258.51,66.61 256.92,66.61 256.92,67.25 255.02,67.25 255.02,70.1
A0_EXT_1
  Top 0.305: R5.2 R4.1 49.05,222.6 arc45 48.96,222.82 48.6,223.18 arc45 48.38,223.28 45.91,223.28 U1.1
A1_EXT_1
  Top 0.305: R7.2 R6.1 49.03,220.34 arc45 48.93,220.56 48.85,220.64 arc45 48.63,220.74 45.08,220.74 arc-45 44.86,220.83 44.67,221.02 arc-45 44.57,221.25 U1.2
A2_EXT_1
  Top 0.305: R3.2 R2.1 49.03,218.05 arc45 48.93,218.28 48.85,218.36 arc45 48.63,218.45 43.59,218.45 arc90 43.27,218.13 U1.21
ADDR0
  Top 0.305: U18.2 270.66,135.03 270.51,135.18 268.31,135.18 265.18,138.32 265.18,159.51 SJ_A1.2
  Top 0.406: SJ_A1.2 SJ_A2.2
CH1+  (via drill 0.35)
  Top 0.305: v208.48,181.23 208.48,168.25 210.59,166.15 210.59,156.72 211.48,155.83 LED+2.MP
  Top 0.61: LED+2.MP 235.87,151.16 253.84,151.16 TP115.TP
  Bottom 0.305: CH1-6.A@1 184.28,167.06 184.3,167.08 208.89,167.08 208.99,167.18 208.99,180.72 v208.48,181.23
  pour Top (isolate 0.305, rank 2): 255.02,159.96 256.92,159.96 256.92,160.91 260.41,160.91 260.41,151.38 254.06,151.38 254.06,156.46 254.7,157.1 254.7,158.05 255.02,158.05
CH1-  (via drill 0.35)
  Top 0.305: v100.33,65.79 v100.33,63.5 | 245.62,156.97 244.93,156.29 L14.2 249.12,156.29 250.57,157.73
  Top 0.406: L14.2 245.11,155.08 245.11,152.15 244.35,152.91 243.84,152.91
  Top 0.559: LED-2.MP 233.49,158.24 235.2,158.24
  Top 0.61: 250.57,157.73 C72.1
  Bottom 0.305: CH1-9.C 100.46,65.91 v100.33,65.79 | v100.33,63.5 100.33,53.34 72.64,53.34 72.64,232.16 202.28,232.16 203.38,231.06 203.38,210.77 210.82,203.33 210.82,193.04 210.82,192.79 210.82,163.83 214.12,160.53 LED-2.MP
  pour Top (isolate 0.305): 254.06,158.05 250.89,158.05 250.89,158.69 235.01,158.69 235.01,151.38 253.43,151.38 253.43,156.46 254.06,157.1
CH2+  (via drill 0.35)
  Top 0.305: v209.25,165.2 209.25,144.69 210.17,143.76 210.17,138.95 212.34,136.78 LED+7.MP | C75.2 255.23,133.5 254.92,133.19
  Top 0.508: 235.9,132.08 LED+7.MP
  Top 0.559: 254.92,133.19 253.81,132.08 235.9,132.08
  Top 0.61: RS7.1 256.69,140.68 U$26.4 255.4,138.85 C75.2
  Bottom 0.305: CH2-6.A 184.28,196.19 205.04,196.19 205.72,195.52 209.56,195.52 209.6,195.48 209.6,165.56 v209.25,165.2
  pour Top (isolate 0.305, rank 2): 255.02,140.91 256.92,140.91 256.92,141.86 260.41,141.86 260.41,132.33 254.06,132.33 254.06,137.41 254.7,138.05 254.7,139 255.02,139
CH2-  (via drill 0.35)
  Top 0.305: v99.31,228.35 v102.11,228.35 | v183.39,230.12 183.39,229.87 v186.18,229.87 | v209.04,202.18 209.04,199.99 209.61,199.41 209.61,183.54 207.65,181.57 207.65,168.3 210.03,165.92 210.03,144.72 212.81,141.94 213.02,141.73 LED-7.MP
  Top 0.559: LED-7.MP 231.71,141.41 235.71,138.68
  Bottom 0.305: CH2-9.C 100.46,115.09 100.58,114.96 74.42,114.96 74.42,229.11 99.31,229.11 v99.31,228.35 | v102.11,228.35 102.46,228.35 105.66,231.55 154.94,231.55 183.39,231.55 v183.39,230.12 | v186.18,229.87 186.82,229.87 187.2,230.25 202.03,230.25 202.16,230.12 202.16,210.19 209.6,202.74 209.6,202.18 v209.04,202.18
  pour Top (isolate 0.305): 254.06,139 250.89,139 250.89,139.64 235.01,139.64 235.01,132.33 253.43,132.33 253.43,137.41 254.06,138.05
CH3+  (via drill 0.35)
  Top 0.305: v211.58,100.08 211.66,100.15 v211.66,103.12 | v211.82,116.31 211.84,116.33 v211.84,118.87 | v212.6,123.19 212.6,122.55 213.56,121.59 213.56,119.06 214.88,117.73 LED+9.MP
  Top 0.559: 255.33,113.28 255.13,113.09 235.85,113.09 LED+9.MP
  Top 0.61: RS9.1 256.69,121.63 U$27.4 255.4,119.8 C78.2
  Bottom 0.305: CH3-6.A@1 184.28,81.74 184.89,82.35 184.89,82.78 184.91,82.8 185.25,82.8 185.33,82.73 194.24,82.73 194.31,82.8 209.9,82.8 210.92,83.82 210.92,99.42 v211.58,100.08 | v211.66,103.12 211.66,116.15 v211.82,116.31 | v211.84,118.87 211.48,119.23 211.48,123.19 v212.6,123.19
  pour Top (isolate 0.305, rank 2): 255.02,121.86 256.92,121.86 256.92,122.81 260.41,122.81 260.41,113.28 254.06,113.28 254.06,118.36 254.7,119 254.7,119.95 255.02,119.95
CH3-  (via drill 0.35)
  Top 0.305: v100.58,170.69 109.89,170.69 111.54,172.34 180.81,172.34 209.61,143.53 209.61,131.89 219.07,122.43 LED-9.MP
  Top 0.559: LED-9.MP 231.2,123.64
  Top 0.61: LED-9.MP 234.25,119.38 235.97,119.38
  Bottom 0.305: CH3-9.C@1 100.46,170.69 v100.58,170.69
  pour Top (isolate 0.305): 254.06,119.95 250.89,119.95 250.89,120.59 235.01,120.59 235.01,113.28 253.43,113.28 253.43,118.36 254.06,119
CH4+
  Top 0.559: 255.33,94.23 255.13,94.04 235.85,94.04 LED+10.MP
  Top 0.61: RS10.1 256.69,102.58 U$28.4 255.4,100.75 C81.2
  Bottom 0.305: CH4-6.A 184.28,230.15 184.99,230.86 202.72,230.86 202.77,230.81 202.77,210.44 210.21,203 210.21,135.38 210.21,135.25 210.21,135.18 213.48,131.91 213.48,99.44 214.25,98.68 LED+10.MP
  pour Top (isolate 0.305, rank 2): 255.02,102.81 256.92,102.81 256.92,103.76 260.41,103.76 260.41,94.23 254.06,94.23 254.06,99.31 254.7,99.95 254.7,100.9 255.02,100.9
CH4-  (via drill 0.35)
  Top 0.305: v111.51,87.38 113.26,87.38 v113.79,86.84 | v168.66,86.36 v171.7,86.36 | v183.39,83.57 v185.67,83.57 | v209.04,112.52 v209.04,115.06 | v140.72,87.38 141.39,87.38 142.02,88.01 142.71,88.01 143.09,87.63 v145.03,87.63 | v208.76,138.18 208.76,125.59 213,121.36 213,104.25 213.87,103.38 LED-10.MP
  Top 0.559: LED-10.MP 231.46,103.57 235.46,100.58
  Bottom 0.305: CH4-9.C 100.46,87.15 100.58,87.02 111.15,87.02 v111.51,87.38 | v113.79,86.84 127.97,86.84 128.14,87.02 140.36,87.02 v140.72,87.38 | v145.03,87.63 145.75,88.34 153.97,88.34 156.57,85.75 168.05,85.75 v168.66,86.36 | v171.7,86.36 171.47,86.13 171.47,83.21 183.03,83.21 v183.39,83.57 | v185.67,83.57 209.8,83.57 210.31,84.07 210.31,101.93 210.21,102.03 210.21,111.35 v209.04,112.52 | v209.04,115.06 210.26,116.28 210.26,132.84 208.76,134.34 v208.76,138.18
  pour Top (isolate 0.305): 254.06,100.9 250.89,100.9 250.89,101.54 235.01,101.54 235.01,94.23 253.43,94.23 253.43,99.31 254.06,99.95
CH5+
  Top 0.559: 255.33,75.18 255.13,74.99 235.85,74.99 LED+11.MP
  Top 0.61: RS11.1 256.69,83.53 U$29.4 255.4,81.7 C84.2
  Bottom 0.305: CH5-6.A 184.28,141.66 184.25,141.68 203.67,141.68 205.72,139.64 208,139.64 209.31,139.68 209.6,139.68 209.6,135 210.87,133.73 210.87,118.37 212.93,116.31 212.93,86.67 219.96,79.63 LED+11.MP
  pour Top (isolate 0.305, rank 2): 255.02,83.76 256.92,83.76 256.92,84.71 260.41,84.71 260.41,75.18 254.06,75.18 254.06,80.26 254.7,80.9 254.7,81.85 255.02,81.85
CH5-  (via drill 0.35)
  Top 0.305: v185.17,139.7 151.41,139.7 145.8,134.09 138.94,134.09 134.09,138.94 134.09,141.99 132.82,143.26 v100.58,143.26 | v209.04,124.21 210.87,122.38 210.87,115.8 212.44,114.23 212.44,96.27 212.34,96.17 212.34,86.87 214.12,85.09 LED-11.MP
  Top 0.559: LED-11.MP 231.2,85.53 235.46,81.28
  Bottom 0.305: v209.04,124.21 209.65,124.82 209.65,132.59 207.93,134.31 207.93,138.85 207.76,139.03 205.46,139.03 203.42,141.07 186.54,141.07 v185.17,139.7 | v100.58,143.26 100.58,154.84 CH5-9.C
  pour Top (isolate 0.305): 254.06,81.85 250.89,81.85 250.89,82.49 235.01,82.49 235.01,75.18 253.43,75.18 253.43,80.26 254.06,80.9
CH6+
  Top 0.559: LED+12.MP 236.66,55.12 254,55.12 256,57.12 256.32,57.12
  Top 0.61: RS12.1 256.69,64.48 U$30.4 255.4,62.65 C87.2
  Bottom 0.305: CH6-6.A 184.28,113.69 184.23,113.74 210.79,113.74 210.82,113.72 210.82,102.21 212.37,100.67 212.37,84.48 210.82,82.93 210.82,66.04 211.96,64.9 216.28,60.58 LED+12.MP
  pour Top (isolate 0.305, rank 2): 255.02,64.71 256.92,64.71 256.92,65.66 260.41,65.66 260.41,56.13 254.06,56.13 254.06,61.21 254.7,61.85 254.7,62.8 255.02,62.8
CH6-  (via drill 0.35)
  Top 0.305: v141.22,151.13 141.48,151.13 arc-90 150.88,141.73 150.88,140.82 151.38,140.31 169.77,140.31 170.18,140.72 204.64,140.72 208.03,137.33 208.03,117.86 210.31,115.57 210.31,111.51 210.31,111.25 210.31,82.3 210.31,69.09 213.61,65.79 LED-12.MP
  Top 0.559: LED-12.MP 231.2,66.99 235.2,62.99
  Bottom 0.305: CH6-9.C@1 100.46,198.81 100.48,198.78 139.59,198.78 139.84,199.03 140.53,199.03 141.2,198.36 141.2,151.1 v141.22,151.13
  pour Top (isolate 0.305): 254.06,62.8 250.89,62.8 250.89,63.44 235.01,63.44 235.01,56.13 253.43,56.13 253.43,61.21 254.06,61.85
D+  (via drill 0.35)
  Top 0.305: v281.43,268.22 v281.43,271.78
  Top 0.559: U$5.PIN2 U$6.PIN2
  Bottom 0.305: U$5.PIN2 225.27,46.26 226.71,44.82 246.36,44.82 248.57,47.03 265.66,47.03 270.28,42.4 270.28,39.37 270.28,37.71 269.73,37.16 269.73,36.51 270.19,36.05 270.83,36.05 271.3,36.51 271.3,36.82 282.65,48.18 282.65,267 v281.43,268.22 | v281.43,271.78 281.22,271.57 J7.2
D-
  Top 0.559: U$6.PIN3 U$5.PIN3
  Bottom 0.305: U$5.PIN3 246.59,44.26 248.8,46.47 265.43,46.47 269.73,42.17 269.73,37.95 269.17,37.39 269.17,36.27 269.95,35.49 271.07,35.49 271.85,36.27 271.85,36.59 283.21,47.95 283.21,268.73 282.19,269.75 281.18,269.75 281,269.57 J7.3
DAC_!CLR!
  Top 0.305: U18.9 275.65,137.98 | 275.65,137.98 276.1,137.53 R88.2 | TP105.1 275.65,137.98
DSCLM0
  Top 0.305: R21.1 153.95,269.28 155.44,269.28 | IC2.6 155.84,267.11 155.44,267.5 155.44,269.28 | J2.DSCLM(5) 159.63,274.36 159.25,273.98 157.6,273.98 157.09,273.47 157.09,271.57 155.69,270.17 155.69,269.28 R20.2 155.44,269.28
DSCLM1  (1 unrouted)
  Top 0.305: R29.1 175.03,269.28 176.52,269.28 | 176.52,269.28 R28.2 | IC3.6 176.92,267.11 176.52,267.5 176.52,269.28 | 176.77,269.28 176.77,270.17 178.17,271.57 178.17,273.47 178.68,273.98 180.33,273.98 180.71,274.36 J3.DSCLM(5)
DSCLP0
  Top 0.305: R21.2 R19.1 154.46,266.62 154.93,266.62 155.06,266.61 IC2.7 158.48,266.61 158.74,266.87 158.74,270.43 J2.DSCLP(4)
DSCLP1
  Top 0.305: R29.2 R27.1 175.54,266.62 176.01,266.62 176.15,266.61 IC3.7 179.56,266.61 179.82,266.87 179.82,270.43 J3.DSCLP(4)
DSDAM0  (via drill 0.35)
  Top 0.305: J2.DSDAM(2) 163.44,272.2 160.01,268.52 160.01,268.27 | IC2.9 158.99,265.6 160.01,266.36 160.01,268.27 | R17.2 R16.1 arc-90 159.5,262.97 v159.5,263.95 | v160.77,268.27 160.01,268.27
  Bottom 0.305: v159.5,263.95 159.5,268.27 v160.77,268.27
DSDAM1  (via drill 0.35)
  Top 0.305: J3.DSDAM(2) 184.52,272.2 181.09,268.52 181.09,268.27 | IC3.9 178.39,265.6 180.08,265.6 181.09,266.36 181.09,268.27 | R25.2 R24.1 arc-90 180.58,262.97 v180.58,263.95 | v181.85,268.27 181.09,268.27
  Bottom 0.305: v180.58,263.95 180.58,268.27 v181.85,268.27
DSDAP0  (via drill 0.35)
  Top 0.305: R18.2 R17.1 156.62,264.12 v156.71,264.2 | 160.26,270.05 159.38,269.16 159.38,266.56 158.92,266.11 IC2.8 | 160.26,270.05 162.17,271.95 162.17,273.22 162.93,273.98 163.57,273.98 J2.DSDAP(1) | v159.76,270.3 160.01,270.3 160.26,270.05
  Bottom 0.305: v156.71,264.2 158.74,266.24 158.74,270.05 158.99,270.3 v159.76,270.3
DSDAP1  (via drill 0.35)
  Top 0.254: IC3.8 179.71,266.11 180.41,266.68
  Top 0.305: R26.2 R25.1 177.7,264.12 v177.79,264.2 | 181.35,270.05 180.46,269.16 180.46,266.87 180.41,266.69 180.41,266.68 | 181.35,270.05 183.25,271.95 183.25,273.22 184.01,273.98 184.65,273.98 J3.DSDAP(1) | v180.84,270.3 181.09,270.3 181.35,270.05
  Bottom 0.305: v177.79,264.2 179.82,266.24 179.82,270.05 180.08,270.3 v180.84,270.3
GND  (via drill 0.25, 0.35, 0.55)
  Top 0.305: C3.2 38.06,222.6 U1.12 37.08,223.59 37.08,224.04 | R5.1 R7.1 R3.1 | U18.14 271.31,141.47 271.58,141.73 v272.08,141.73
  Top 0.406: U9.7 47.45,105.31 47.36,105.4 U9.EP | D8.C 44.06,252.68 C21.2 | C70.2 253.85,161.6 U$25.44 252.16,161.23 | C74.2 253.85,142.55 U$26.44 252.16,142.18 | C77.2 253.85,123.5 U$27.44 252.16,123.13 | C80.2 253.85,104.45 U$28.44 252.16,104.08 | C83.2 253.85,85.4 U$29.44 252.16,85.03 | C86.2 253.85,66.35 U$30.44 252.16,65.98
  Top 0.61: v213.39,214.09 213.61,213.87 v208.87,213.87 | v213.07,216.63 213.11,216.66
  other vias: 162.3,268.52 162.04,264.2 157.22,268.01 157.98,270.81 183.12,264.2 178.3,268.01 178.81,270.55 51.81,225.31 44.31,87.62 45.07,108.7 42.67,248.92 38.35,241.05 40.64,239.27 28.96,200.66 31.93,203.23 53.62,208.03 52.83,210.31 133.1,241.81 23.62,83.06 32.77,77.47 52.07,76.45 60.2,78.23 57.91,111 63.5,124.71 62.74,128.52 64.26,132.08 68.33,136.14 55.63,144.02 24.38,156.72 25.91,170.43 22.35,129.29 24.38,115.06 30.23,108.46 26.16,223.01 24.13,232.41 58.17,231.9 64.77,218.95 58.67,250.19 45.21,277.88 64.52,279.4 79.76,271.27 110.49,269.24 95.76,268.99 81.03,281.69 109.73,281.94 98.3,281.69 117.35,280.67 121.67,280.67 125.22,280.67 130.05,280.42 142.24,280.16 146.3,282.19 141.22,274.32 134.37,271.02 124.46,270.76 117.6,271.02 145.29,267.72 160.02,240.28 179.83,247.4 197.61,243.84 201.42,249.94 213.36,257.81 246.63,257.3 242.32,225.55 229.36,225.04 214.12,238.51 232.16,227.33 275.08,241.81 116.84,14.22 148.84,12.95 142.75,21.59 145.03,34.29 121.16,37.34 111,37.34 114.81,27.94 120.65,18.29 133.86,15.24 141.99,16 58.17,208.03 17.02,62.23 17.27,58.42 17.27,57.4 17.27,56.39 18.03,56.9 18.03,57.91 253.24,159.89 253.75,159.89 254.25,159.89 254.25,159.38 253.75,159.38 253.24,159.38 253.24,158.88 253.75,158.88 254.25,158.88 256.16,161.8 256.16,161.16 256.16,160.53 251.08,160.53 251.08,161.16 251.08,161.8 250.44,160.21 250.44,160.85 250.44,161.48 250.44,162.12 256.16,167.51 256.16,168.15 256.79,168.47 257.56,168.47 258.38,168.47 259.02,168.15 259.02,167.51 253.24,140.84 253.75,140.84 254.25,140.84 254.25,140.34 253.75,140.34 253.24,140.34 253.24,139.83 253.75,139.83 254.25,139.83 256.16,142.75 256.16,142.11 256.16,141.48 251.08,141.48 251.08,142.11 251.08,142.75 250.44,141.16 250.44,141.8 250.44,142.43 250.44,143.07 256.16,148.46 256.16,149.1 256.79,149.42 257.56,149.42 258.38,149.42 259.02,149.1 259.02,148.46 253.24,121.79 253.75,121.79 254.25,121.79 254.25,121.28 253.75,121.28 253.24,121.28 253.24,120.78 253.75,120.78 254.25,120.78 256.16,123.7 256.16,123.06 256.16,122.43 251.08,122.43 251.08,123.06 251.08,123.7 250.44,122.11 250.44,122.75 250.44,123.38 250.44,124.02 256.16,129.41 256.16,130.05 256.79,130.37 257.56,130.37 258.38,130.37 259.02,130.05 259.02,129.41 253.24,102.74 253.75,102.74 254.25,102.74 254.25,102.23 253.75,102.23 253.24,102.23 253.24,101.73 253.75,101.73 254.25,101.73 256.16,104.65 256.16,104.01 256.16,103.38 251.08,103.38 251.08,104.01 251.08,104.65 250.44,103.06 250.44,103.7 250.44,104.33 250.44,104.97 256.16,110.36 256.16,111 256.79,111.32 257.56,111.32 258.38,111.32 259.02,111 259.02,110.36 253.24,83.69 253.75,83.69 254.25,83.69 254.25,83.19 253.75,83.19 253.24,83.19 253.24,82.68 253.75,82.68 254.25,82.68 256.16,85.6 256.16,84.96 256.16,84.33 251.08,84.33 251.08,84.96 251.08,85.6 250.44,84.01 250.44,84.65 250.44,85.28 250.44,85.92 256.16,91.31 256.16,91.95 256.79,92.27 257.56,92.27 258.38,92.27 259.02,91.95 259.02,91.31 253.24,64.64 253.75,64.64 254.25,64.64 254.25,64.14 253.75,64.14 253.24,64.14 253.24,63.63 253.75,63.63 254.25,63.63 256.16,66.55 256.16,65.91 256.16,65.28 251.08,65.28 251.08,65.91 251.08,66.55 250.44,64.96 250.44,65.6 250.44,66.23 250.44,66.87 256.16,72.26 256.16,72.9 256.79,73.22 257.56,73.22 258.38,73.22 259.02,72.9 259.02,72.26 270.76,115.57 276.1,110.49 269.75,107.7 272.29,97.54 268.99,84.84 276.35,76.96 270.26,77.22 38.61,8.89 33.78,5.33 26.67,12.95 45.72,18.03 49.15,11.18 37.47,10.92 52.58,3.81 15.49,245.87 11.94,250.7 19.56,257.81 24.64,238.76 17.78,235.33 17.53,247.01 241.3,277.62 246.13,281.18 253.24,273.56 234.19,268.48 230.76,275.34 242.44,275.59 227.33,282.7 271.02,127
  pour Top (isolate 0.406): 53.71,95.75 41.01,95.75 41.01,110.99 53.71,110.99
  pour Top (isolate 0.305): 52.44,114.8 52.44,124.96 41.01,124.96 41.01,114.8
  pour Top (isolate 0.305): 53.71,80.51 53.71,91.94 41.01,91.94 41.01,80.51
  pour Top (isolate 0.305): 66.78,150.31 29.95,150.31 29.95,129.99 66.78,129.99
  pour Top (isolate 0.305, rank 3): -0.51,285.24 284.99,285.24 284.99,-0.51 -0.76,-0.51 -0.76,279.15
  pour Bottom (isolate 0.305, rank 3): -0.25,284.73 284.73,284.73 284.73,0.25 -0.25,0.25 -0.51,281.94 -2.79,282.19 -2.79,283.21 -0.51,283.97
  pour Top (isolate 0.406, rank 3): 48.26,261.37 35.56,261.37 35.56,238.51 48.26,238.51
ISO_3V3_2
  Top 0.559: 29.46,14.64 26.84,14.64 26.04,13.84 J9.4 | 29.46,14.64 C12.1 33.91,14.64 U5.8 33.91,15.37 35.64,17.09 42.6,17.09 44.11,15.58 C4.1 50.33,15.58 U2.4 | 29.46,14.64 29.45,14.63 R34.2 R36.2
ISO_3V3_3
  Top 0.559: 21.25,255.02 21.25,257.64 20.45,258.44 J10.4 | 21.25,255.02 C20.1 21.25,250.57 U7.8 21.97,250.57 23.7,248.84 23.7,241.88 22.19,240.37 C18.1 22.19,234.15 U6.4 | 21.25,255.02 21.23,255.03 R38.2 R40.2
ISO_3V3_4
  Top 0.559: 250.44,271.87 253.07,271.87 253.87,272.67 J8.4 | 250.44,271.87 C27.1 246,271.87 U13.8 246,271.14 244.27,269.42 237.31,269.42 235.8,270.93 C24.1 229.58,270.93 U8.4 | 250.44,271.87 250.46,271.88 R43.2 R46.2
ISO_GND_2  (via drill 0.35)
  Top 0.559: U2.3 49.15,12.57 47.84,13.88 C4.2 41.95,13.88 J9.3 | U5.5 v37.72,12.32 | v32.51,16.26 30.82,16.26 C12.2
  Bottom 0.559: 41.02,13.84 J9.3 | v37.72,12.32 38.73,12.32 40.26,13.84 J9.3 | J9.3 41.91,15.24 40.89,16.26 v32.51,16.26
ISO_GND_3  (via drill 0.35)
  Top 0.559: U6.3 19.18,235.33 20.49,236.64 C18.2 20.49,242.53 J10.3 | U7.5 v18.92,246.76 | v22.86,251.97 22.86,253.66 C20.2
  Bottom 0.559: 20.45,243.46 J10.3 | v18.92,246.76 18.92,245.75 20.45,244.22 J10.3 | J10.3 21.84,242.57 22.86,243.59 v22.86,251.97
ISO_GND_4  (via drill 0.35)
  Top 0.559: U8.3 230.76,273.94 232.07,272.63 C24.2 237.96,272.63 J8.3 | U13.5 v242.19,274.19 | v247.4,270.26 249.09,270.26 C27.2
  Bottom 0.559: 238.89,272.67 J8.3 | v242.19,274.19 241.17,274.19 239.65,272.67 J8.3 | J8.3 238,271.27 239.01,270.26 v247.4,270.26
ISO_SCL_2
  Top 0.305: J9.1 40.51,8.76 38.86,10.41 38.86,15.24 38.35,15.75 36.83,15.75 36.45,15.37 U5.6 36.45,12.83 35.71,12.09 32.16,12.09 31.75,11.68 R36.1
ISO_SCL_3
  Top 0.305: J10.1 15.37,243.97 17.02,245.62 21.84,245.62 22.35,246.13 22.35,247.65 21.97,248.03 U7.6 19.43,248.03 18.69,248.77 18.69,252.32 18.29,252.73 R40.1
ISO_SCL_4
  Top 0.305: J8.1 239.4,277.75 241.05,276.1 241.05,271.27 241.55,270.76 243.08,270.76 243.46,271.14 U13.6 243.46,273.69 244.2,274.42 247.75,274.42 248.16,274.83 R46.1
ISO_SDA_2
  Top 0.305: R34.1 32,12.95 32.26,12.7 35.05,12.7 35.18,12.83 U5.7 35.18,15.37 36.17,16.36 38.61,16.36 39.47,15.49 39.47,12.34 40.51,11.3 J9.2
ISO_SDA_3
  Top 0.305: R38.1 19.56,252.48 19.3,252.22 19.3,249.43 19.43,249.3 U7.7 21.97,249.3 22.96,248.31 22.96,245.87 22.1,245.01 18.95,245.01 17.91,243.97 J10.2
ISO_SDA_4
  Top 0.305: R43.1 247.9,273.56 247.65,273.81 244.86,273.81 244.73,273.69 U13.7 244.73,271.14 243.74,270.15 241.3,270.15 240.44,271.02 240.44,274.17 239.4,275.21 J8.2
LED+
  Top 0.61: RS2.1 256.69,159.73 U$25.4 255.4,157.9 C72.2
LX
  pour Top (isolate 0.305, no thermals): 252.79,162.5 251.52,162.5 250.89,163.13 236.92,163.13 236.92,167.89 252.48,167.89 252.79,167.58
LX_2
  pour Top (isolate 0.305, no thermals): 252.79,143.45 251.52,143.45 250.89,144.08 236.92,144.08 236.92,148.84 252.48,148.84 252.79,148.53
LX_3
  pour Top (isolate 0.305, no thermals): 252.79,124.4 251.52,124.4 250.89,125.03 236.92,125.03 236.92,129.79 252.48,129.79 252.79,129.48
LX_4
  pour Top (isolate 0.305, no thermals): 252.79,105.35 251.52,105.35 250.89,105.98 236.92,105.98 236.92,110.74 252.48,110.74 252.79,110.43
LX_5
  pour Top (isolate 0.305, no thermals): 252.79,86.3 251.52,86.3 250.89,86.93 236.92,86.93 236.92,91.69 252.48,91.69 252.79,91.38
LX_6
  pour Top (isolate 0.305, no thermals): 252.79,67.25 251.52,67.25 250.89,67.88 236.92,67.88 236.92,72.64 252.48,72.64 252.79,72.33
N$1
  Top 0.559: T4.3 222.53,34.1 R13.1 R14.1
N$2
  Top 0.305: R11.1 D3.A
N$3
  Top 0.61: T3.3 271.06,260.86 R49.1 R48.1
N$4
  Top 0.305: R12.1 D4.A
N$5  (via drill 0.35)
  Top 0.61: T3.1 273.81,262.92 v273.81,265.18
  Bottom 0.61: v273.81,265.18 273.81,265.29 J7.4
N$8
  Top 0.559: T4.1 223.5,42.23 U$5.PIN4
N$12
  Top 0.305: R10.1 D2.A
N$29  (via drill 0.35)
  Top 0.305: v115.7,142.29 v110.62,142.29
  Bottom 0.305: CH2-8.C 128.4,142.29 v115.7,142.29 | v110.62,142.29 100.46,142.29 CH2-9.A@1
N$31  (via drill 0.35)
  Top 0.305: v142.37,85.14 v142.37,87.17 | v143.64,168.96 v138.18,168.96
  Bottom 0.305: CH2-7.C@1 156.34,63.55 142.37,63.55 v142.37,85.14 | v138.18,168.96 128.4,168.96 CH2-8.A@1 | v143.64,168.96 143.64,168.55 142.98,167.89 142.98,165.87 143.03,165.82 143.03,150.65 145.8,150.65 150.65,145.8 150.65,138.94 145.8,134.09 142.47,134.09 142.47,91.23 143.13,90.57 143.13,88.44 v142.37,87.17
N$32  (via drill 0.35)
  Top 0.305: v171.65,167.69 v169.04,167.69
  Bottom 0.305: CH2-6.C@1 184.28,167.69 v171.65,167.69 | v169.04,167.69 169.75,166.98 169.75,85.14 156.34,85.14 CH2-7.A
N$33  (via drill 0.35)
  Top 0.305: v110.62,170.23 v114.43,170.23
  Bottom 0.305: CH4-9.A 100.46,114.35 111.89,114.35 111.89,170.23 v110.62,170.23 | v114.43,170.23 128.4,170.23 CH4-8.C
N$34  (via drill 0.35)
  Top 0.305: v143.64,171.5 144.91,171.5 v144.91,167.69 | v140.19,198.2 143.61,198.2 v143.64,198.17
  Bottom 0.305: CH4-8.A 128.4,198.17 140.16,198.17 v140.19,198.2 | v143.64,198.17 143.64,196.9 142.37,196.9 142.37,171.5 v143.64,171.5 | v144.91,167.69 143.64,167.69 143.64,151.26 146.05,151.26 151.26,146.05 151.26,138.69 145.95,133.38 143.08,133.38 143.08,118.16 156.34,118.16 CH4-7.C@1
N$35  (via drill 0.35)
  Top 0.305: v172.85,196.9 v169.04,196.9
  Bottom 0.305: CH4-6.C 184.28,196.9 v172.85,196.9 | v169.04,196.9 169.04,196.34 169.75,195.63 169.75,169.51 168.25,168.02 168.25,167.37 169.04,166.58 169.04,139.75 156.34,139.75 CH4-7.A@1
N$36
  Bottom 0.305: CH6-8.C 128.4,64.82 73.79,64.82 73.79,229.92 100.46,229.92 CH6-9.A
N$37  (via drill 0.35)
  Top 0.305: v144.78,120.9 144.02,120.14 v144.02,117.09
  Bottom 0.305: CH6-7.C@1 156.34,141.02 152.53,141.02 152.48,140.97 152.48,138.18 146.45,132.16 144.3,132.16 144.3,121.41 v144.78,120.9 | CH6-8.A 128.4,86.41 143.64,86.41 143.64,87.28 143.74,87.38 143.74,90.82 143.08,91.48 143.08,115.9 144.02,116.84 v144.02,117.09
N$42
  Top 0.406: U9.4 U9.5
N$43